# Altium schematic sheet W25Q128.SchDoc
size A4
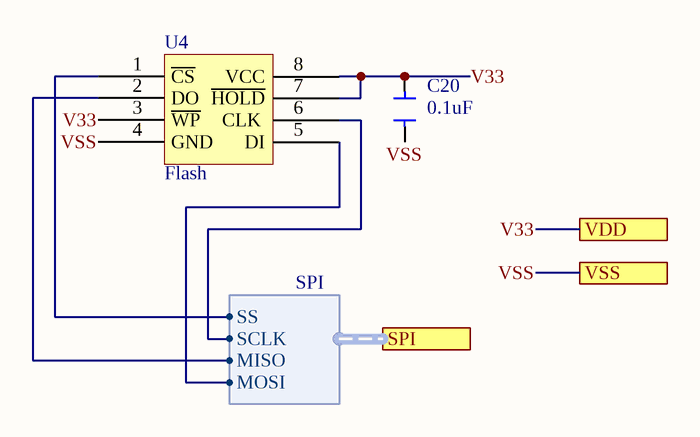
[diagram p0: W25Q128.SchDoc]

## Parts
C20  value 0.1uF  [CAP_0402]  (hidden comment: Cap)
U4  Flash  [8-Pin SOIC 208-mil]

## Ports
SPI (harness SPI), VDD, VSS

## Harnesses
SPI: SS, MISO, MOSI, SCLK

## Nets
V33: C20.1 U4.3(~{WP}) U4.7(~{HOLD}) U4.8(VCC) ; port VDD
VSS: C20.2 U4.4(GND) ; port VSS
NetU4_1: U4.1(~{CS}) ; port SPI.SS
NetU4_2: U4.2(DO) ; port SPI.MISO
NetU4_5: U4.5(DI) ; port SPI.MOSI
NetU4_6: U4.6(CLK) ; port SPI.SCLK

## Library data of the parts
U4 = W25QXX